# EAGLE schematic r3eflow-v3 (EAGLE 9.3.2)
DESIGNER: Rafael Silva; REVISION: hv0a

## Sheet 1 of 4: Main Controller
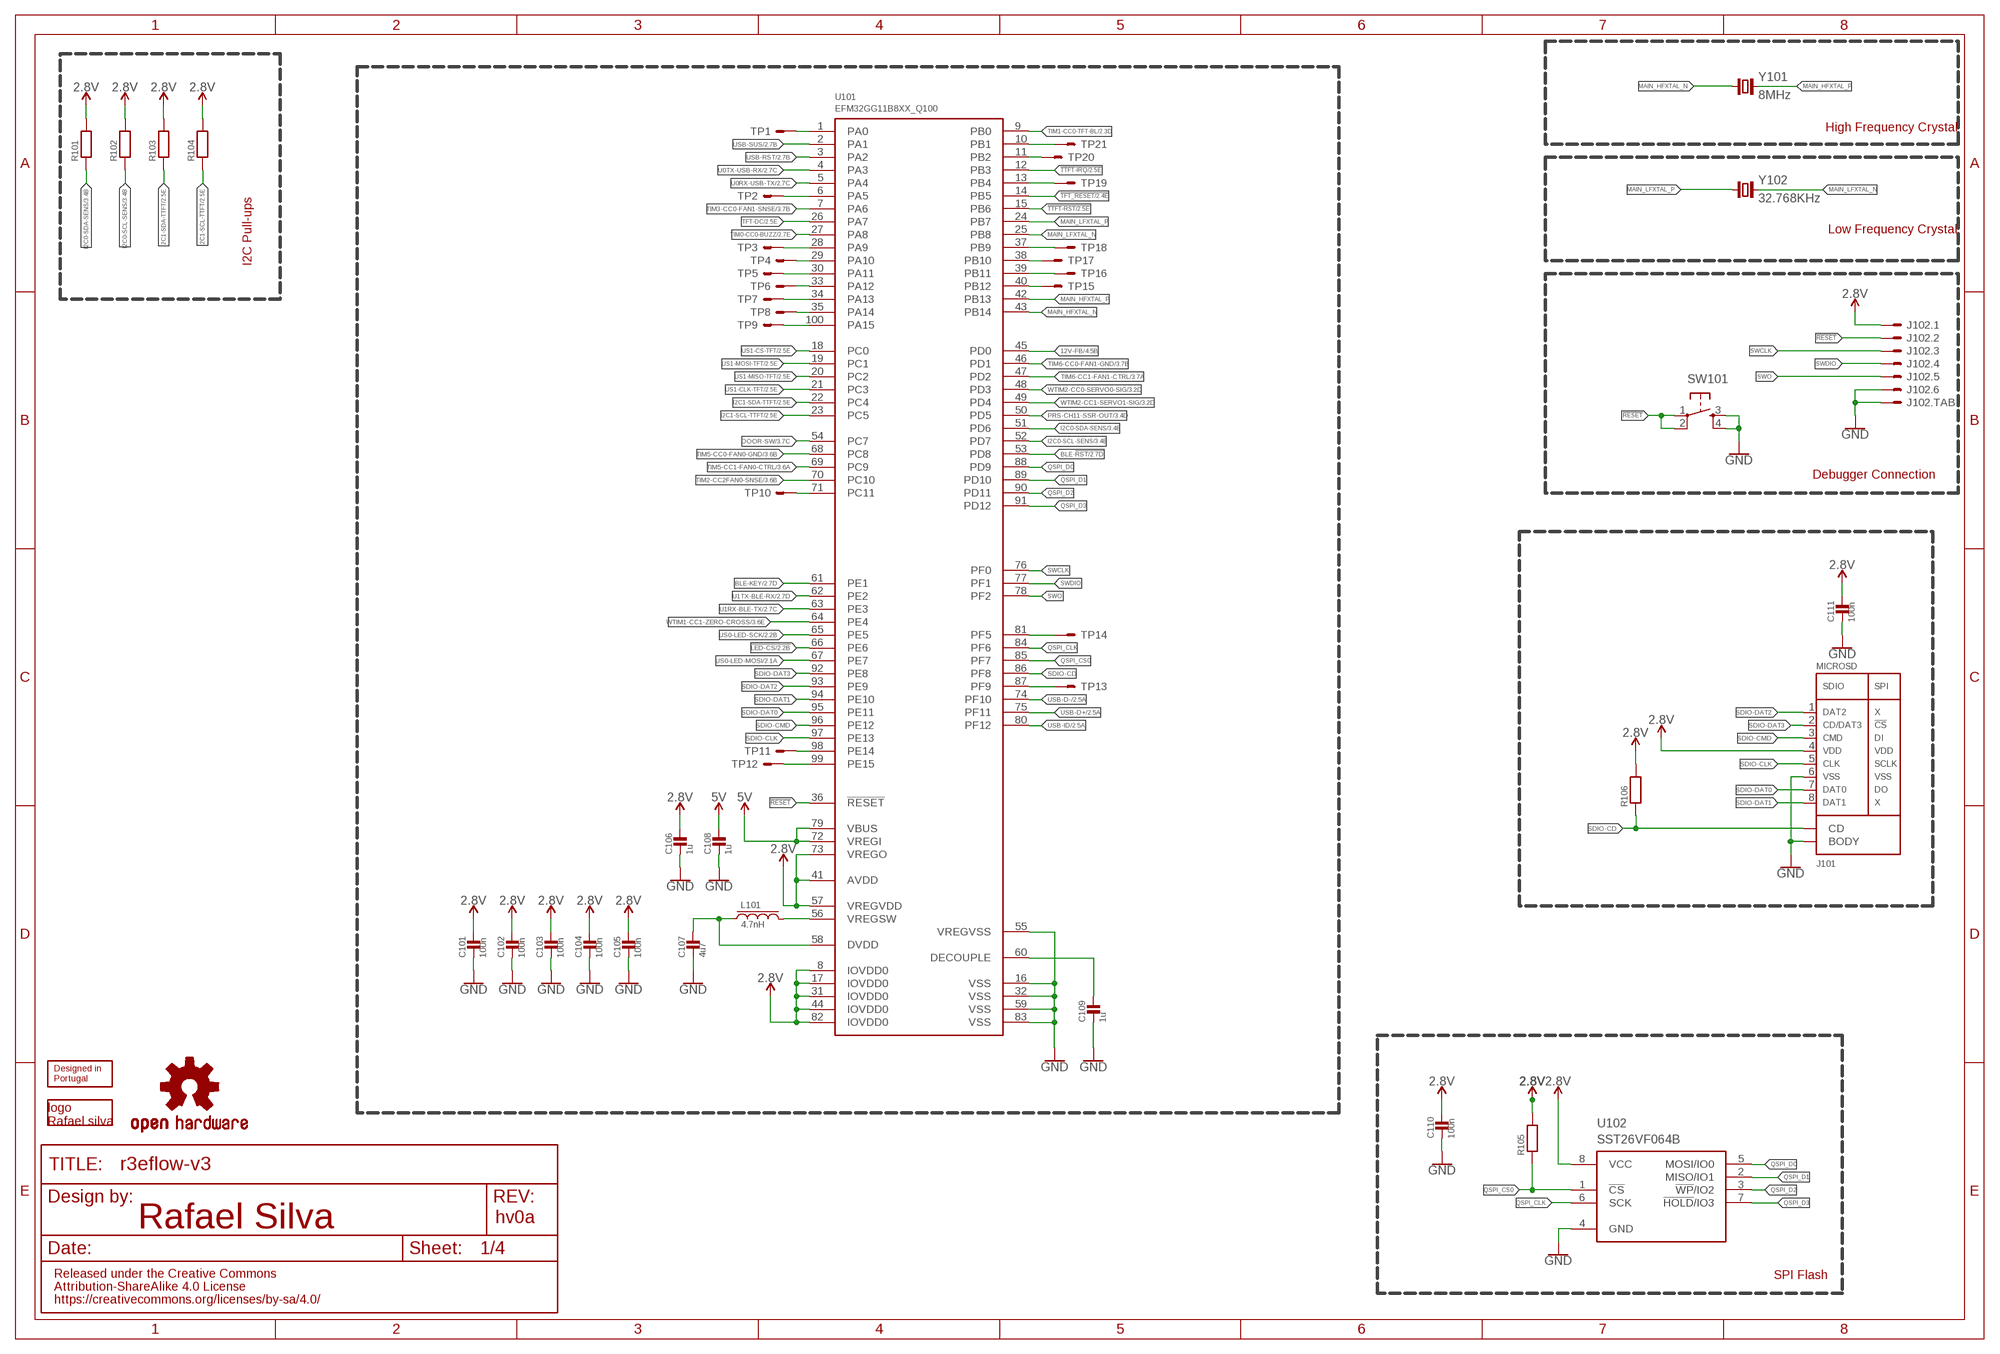
[diagram p0: schematic, sheet 1]

### Parts
C101  100n  MLCC0603  [0603_WAVE]
C102  100n  MLCC0603  [0603_WAVE]
C103  100n  MLCC0603  [0603_WAVE]
C104  100n  MLCC0603  [0603_WAVE]
C105  100n  MLCC0603  [0603_WAVE]
C106  1u  MLCC0603  [0603_WAVE]
C107  4u7  MLCC0603  [0603_WAVE]
C108  1u  MLCC0603  [0603_WAVE]
C109  1u  MLCC0603  [0603_WAVE]
C110  100n  MLCC0603  [0603_WAVE]
C111  100n  MLCC0603  [0603_WAVE]
J101  MICROSD  [MICRO-SD]
J102  SH-6  [SM06B-SSR-H-TB]
L101  4.7nH  INDUCTOR  [_0805]
LOGO101  DESIGNEDINPT  [DESIGNEDINPT]
LOGO102  RAFAEL_SILVA  [RAFAEL_SILVA_5MM_ALT_3]
LOGO103  OSHW-LOGOL  [OSHW-LOGO-L]
R101  RESISTOR0603  [0603_WAVE]
R102  RESISTOR0603  [0603_WAVE]
R103  RESISTOR0603  [0603_WAVE]
R104  RESISTOR0603  [0603_WAVE]
R105  RESISTOR0603  [0603_WAVE]
R106  RESISTOR0603  [0603_WAVE]
SW101  PUSH_BUTTON  [PUSH_BUTTON]
TP1  TEST_POINT  [TEST_POINT]
TP2  TEST_POINT  [TEST_POINT]
TP3  TEST_POINT  [TEST_POINT]
TP4  TEST_POINT  [TEST_POINT]
TP5  TEST_POINT  [TEST_POINT]
TP6  TEST_POINT  [TEST_POINT]
TP7  TEST_POINT  [TEST_POINT]
TP8  TEST_POINT  [TEST_POINT]
TP9  TEST_POINT  [TEST_POINT]
TP10  TEST_POINT  [TEST_POINT]
TP11  TEST_POINT  [TEST_POINT]
TP12  TEST_POINT  [TEST_POINT]
TP13  TEST_POINT  [TEST_POINT]
TP14  TEST_POINT  [TEST_POINT]
TP15  TEST_POINT  [TEST_POINT]
TP16  TEST_POINT  [TEST_POINT]
TP17  TEST_POINT  [TEST_POINT]
TP18  TEST_POINT  [TEST_POINT]
TP19  TEST_POINT  [TEST_POINT]
TP20  TEST_POINT  [TEST_POINT]
TP21  TEST_POINT  [TEST_POINT]
U101  EFM32GG11B8XX_Q100  [QFP100]
U102  SST26VF064B  [WSOIC8]
Y101  8MHz  CRYSTALNX5032GA  [2-SMD-5X3]
Y102  32.768KHz  CRYSTALCM200S  [CM200S]

### Nets
2.8V: C101.P$1 C102.P$1 C103.P$1 C104.P$1 C105.P$1 C106.P$1 C110.P$1 C111.P$1 J101.4 J102.1 R101.P$2 R102.P$2 R103.P$2 R104.P$2 R105.P$2 R106.P$2 U101.8(IOVDD0) U101.17(IOVDD0) U101.31(IOVDD0) U101.41(AVDD) U101.44(IOVDD0) U101.57(VREGVDD) U101.73(VREGO) U101.82(IOVDD0) U102.8(VCC) ; also sheet 2,3
5V: C108.P$1 U101.72(VREGI) U101.79(VBUS) ; also sheet 2,3,4
12V-FB: U101.45(PD0) ; also sheet 4
!LED-CS: U101.66(PE6) ; also sheet 2
!RESET: J102.2 SW101.1 SW101.2 U101.36(!RESET)
!TFT_RESET: U101.14(PB5) ; also sheet 2
!TTFT-IRQ: U101.12(PB3) ; also sheet 2
!TTFT-RST: U101.15(PB6) ; also sheet 2
BLE-!RST: U101.53(PD8) ; also sheet 2
BLE-KEY: U101.61(PE1) ; also sheet 2
DECOUPLE: C109.P$1 U101.60(DECOUPLE)
DOOR-SW: U101.54(PC7) ; also sheet 3
DVDD: C107.P$1 L101.1 U101.58(DVDD)
GND: C101.P$2 C102.P$2 C103.P$2 C104.P$2 C105.P$2 C106.P$2 C107.P$2 C108.P$2 C109.P$2 C110.P$2 C111.P$2 J101.6 J101.BODY1(BODY) J101.BODY2(BODY) J101.BODY3(BODY) J101.BODY4(BODY) J102.6 J102.FIT@1 J102.FIT@2 SW101.3 SW101.4 U101.16(VSS) U101.32(VSS) U101.55(VREGVSS) U101.59(VSS) U101.83(VSS) U102.4(GND) ; also sheet 2,3,4
I2C0-SCL-SENS: R102.P$1 U101.52(PD7) ; also sheet 3
I2C0-SDA-SENS: R101.P$1 U101.51(PD6) ; also sheet 3
I2C1-SCL-TTFT: R104.P$1 U101.23(PC5) ; also sheet 2
I2C1-SDA-TTFT: R103.P$1 U101.22(PC4) ; also sheet 2
MAIN_HFXTAL_N: U101.43(PB14) Y101.1
MAIN_HFXTAL_P: U101.42(PB13) Y101.2
MAIN_LFXTAL_N: U101.25(PB8) Y102.4
MAIN_LFXTAL_P: U101.24(PB7) Y102.1
PA0: TP1.1(S) U101.1(PA0)
PA5: TP2.1(S) U101.6(PA5)
PA9: TP3.1(S) U101.28(PA9)
PA10: TP4.1(S) U101.29(PA10)
PA11: TP5.1(S) U101.30(PA11)
PA12: TP6.1(S) U101.33(PA12)
PA13: TP7.1(S) U101.34(PA13)
PA14: TP8.1(S) U101.35(PA14)
PA15: TP9.1(S) U101.100(PA15)
PB1: TP21.1(S) U101.10(PB1)
PB2: TP20.1(S) U101.11(PB2)
PB4: TP19.1(S) U101.13(PB4)
PB9: TP18.1(S) U101.37(PB9)
PB10: TP17.1(S) U101.38(PB10)
PB11: TP16.1(S) U101.39(PB11)
PB12: TP15.1(S) U101.40(PB12)
PC11: TP10.1(S) U101.71(PC11)
PE14: TP11.1(S) U101.98(PE14)
PE15: TP12.1(S) U101.99(PE15)
PF5: TP14.1(S) U101.81(PF5)
PF9: TP13.1(S) U101.87(PF9)
PRS-CH11-SSR-OUT: U101.50(PD5) ; also sheet 3
QSPI_CLK: U101.84(PF6) U102.6(SCK)
QSPI_CS0: R105.P$1 U101.85(PF7) U102.1(!CS!)
QSPI_D0: U101.88(PD9) U102.5(MOSI/IO0)
QSPI_D1: U101.89(PD10) U102.2(MISO/IO1)
QSPI_D2: U101.90(PD11) U102.3(!WP!/IO2)
QSPI_D3: U101.91(PD12) U102.7(!HOLD!/IO3)
SDIO-CD: J101.9(CD) R106.P$1 U101.86(PF8)
SDIO-CLK: J101.5 U101.97(PE13)
SDIO-CMD: J101.3 U101.96(PE12)
SDIO-DAT0: J101.7 U101.95(PE11)
SDIO-DAT1: J101.8 U101.94(PE10)
SDIO-DAT2: J101.1 U101.93(PE9)
SDIO-DAT3: J101.2 U101.92(PE8)
SWCLK: J102.3 U101.76(PF0)
SWDIO: J102.4 U101.77(PF1)
SWO: J102.5 U101.78(PF2)
TFT-DC: U101.26(PA7) ; also sheet 2
TIM0-CC0-BUZZ: U101.27(PA8) ; also sheet 2
TIM1-CC0-TFT-BL: U101.9(PB0) ; also sheet 2
TIM2-CC2FAN0-SNSE: U101.70(PC10) ; also sheet 3
TIM3-CC0-FAN1-SNSE: U101.7(PA6) ; also sheet 3
TIM5-CC0-FAN0-GND: U101.68(PC8) ; also sheet 3
TIM5-CC1-FAN0-CTRL: U101.69(PC9) ; also sheet 3
TIM6-CC0-FAN1-GND: U101.46(PD1) ; also sheet 3
TIM6-CC1-FAN1-CTRL: U101.47(PD2) ; also sheet 3
U0RX-USB-TX: U101.5(PA4) ; also sheet 2
U0TX-USB-RX: U101.4(PA3) ; also sheet 2
U1RX-BLE-TX: U101.63(PE3) ; also sheet 2
U1TX-BLE-RX: U101.62(PE2) ; also sheet 2
US0-LED-MOSI: U101.67(PE7) ; also sheet 2
US0-LED-SCK: U101.65(PE5) ; also sheet 2
US1-CLK-TFT: U101.21(PC3) ; also sheet 2
US1-CS-TFT: U101.18(PC0) ; also sheet 2
US1-MISO-TFT: U101.20(PC2) ; also sheet 2
US1-MOSI-TFT: U101.19(PC1) ; also sheet 2
USB-D+: U101.75(PF11) ; also sheet 2
USB-D-: U101.74(PF10) ; also sheet 2
USB-ID: U101.80(PF12) ; also sheet 2
USB-RST: U101.3(PA2) ; also sheet 2
USB-SUS: U101.2(PA1) ; also sheet 2
VREGSW: L101.2 U101.56(VREGSW)
WTIM1-CC1-ZERO-CROSS: U101.64(PE4) ; also sheet 3
WTIM2-CC0-SERVO0-SIG: U101.48(PD3) ; also sheet 3
WTIM2-CC1-SERVO1-SIG: U101.49(PD4) ; also sheet 3

### Notes on the sheet
- High Frequency Crystal
- Low Frequency Crystal
- I2C Pull-ups
- Debugger Connection
- SPI Flash

## Sheet 2 of 4: User Interface
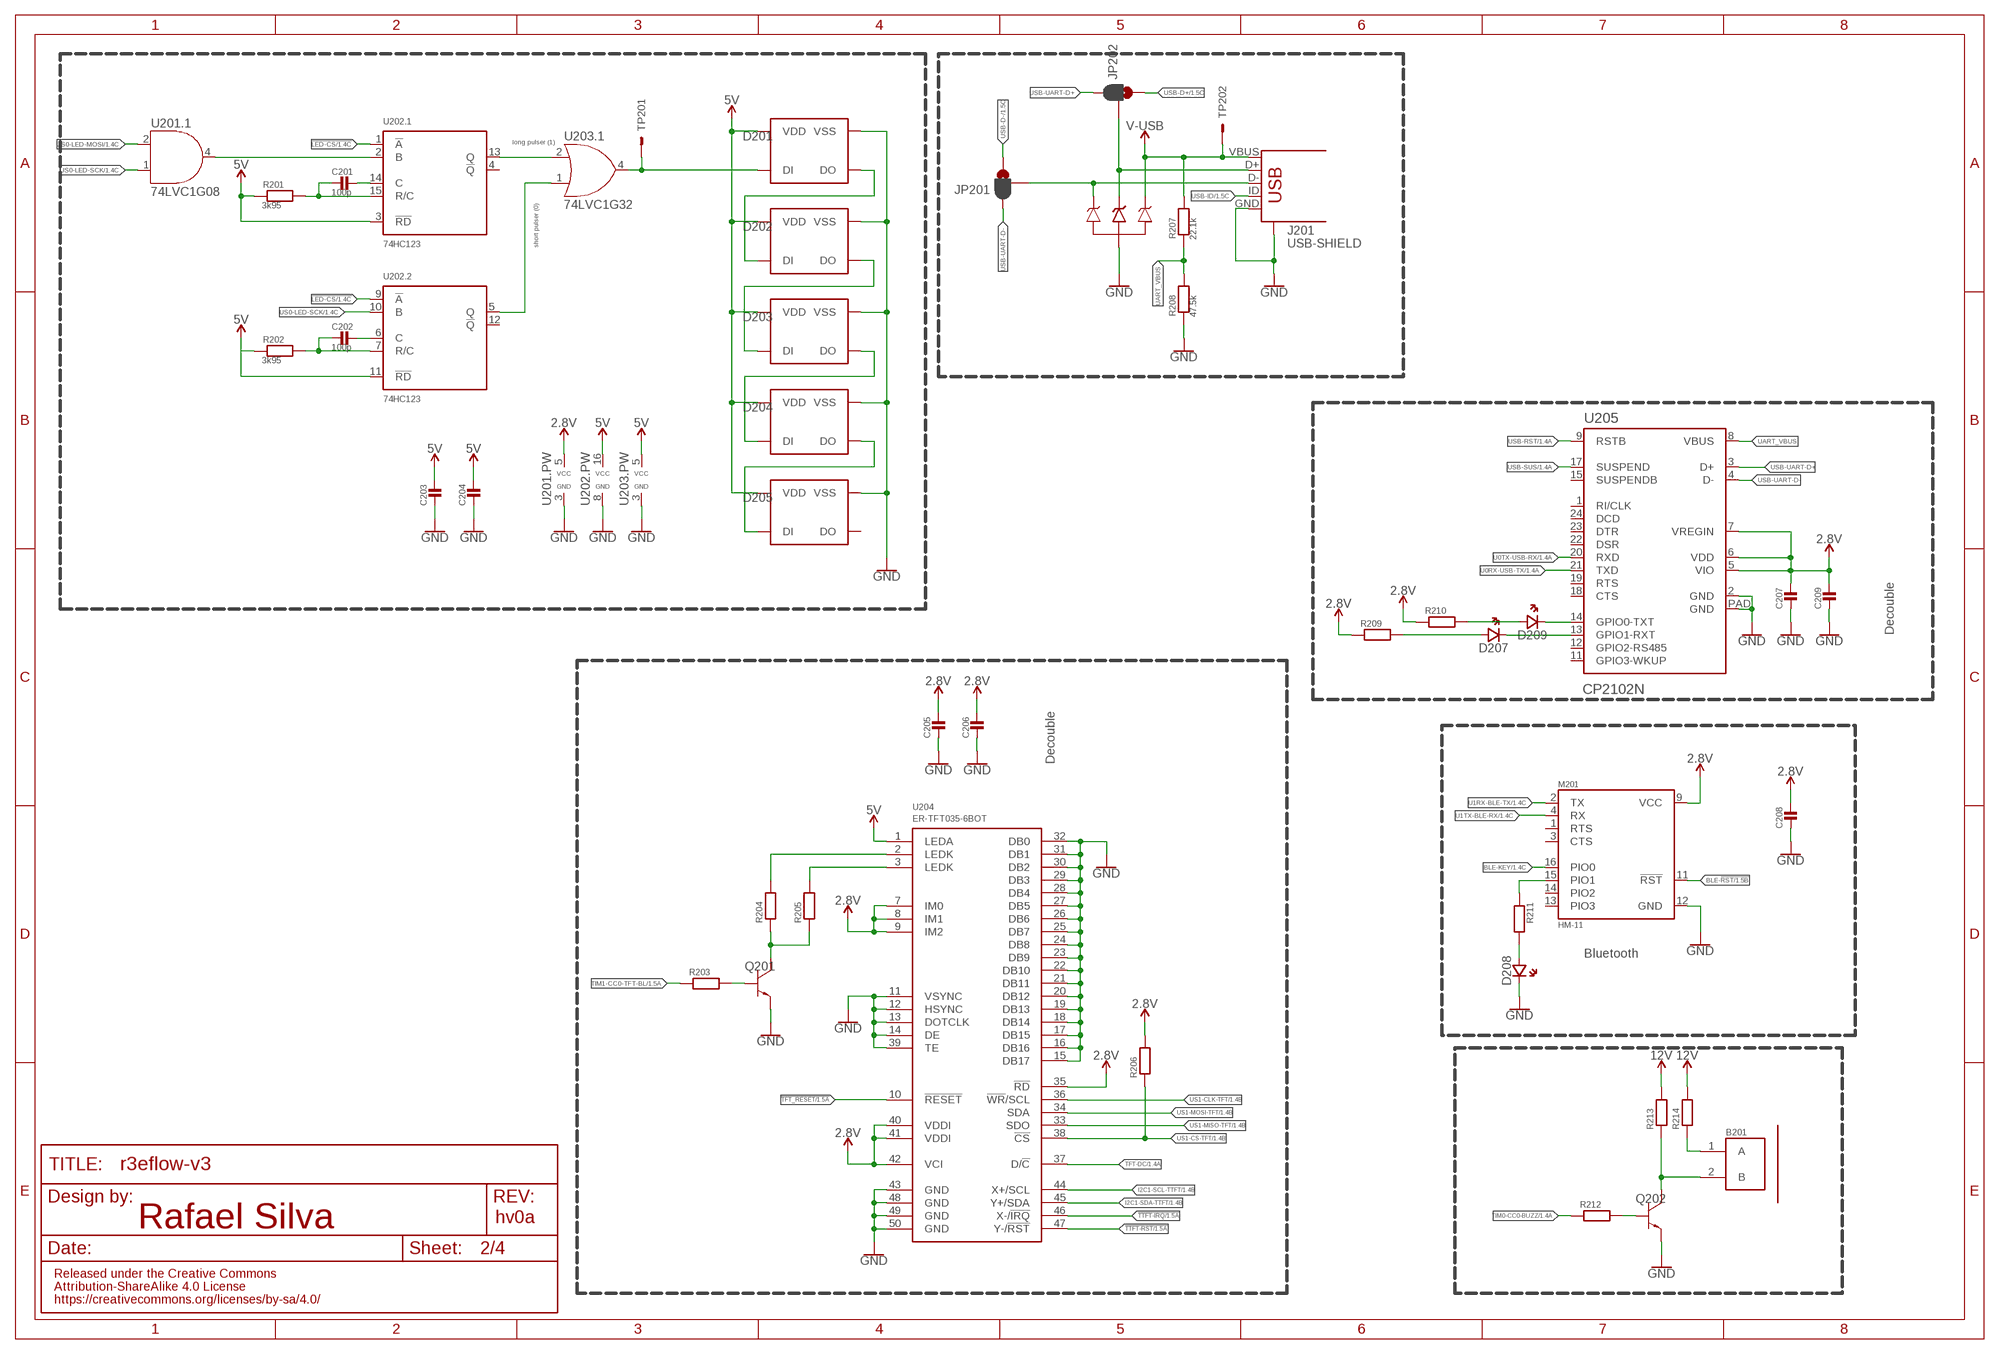
[diagram p1: schematic, sheet 2]

### Parts
B201  PKLCS1212E2400-R1  [BUZZ_PIEZO_SMD]
C201  100p  MLCC0603  [0603_WAVE]
C202  100p  MLCC0603  [0603_WAVE]
C203  MLCC0603  [0603_WAVE]
C204  MLCC0603  [0603_WAVE]
C205  MLCC0603  [0603_WAVE]
C206  MLCC0603  [0603_WAVE]
C207  MLCC0603  [0603_WAVE]
C208  MLCC0603  [0603_WAVE]
C209  MLCC0603  [0603_WAVE]
D201  WS2812B  WS2812B3535  [3535]
D202  WS2812B  WS2812B3535  [3535]
D203  WS2812B  WS2812B3535  [3535]
D204  WS2812B  WS2812B3535  [3535]
D205  WS2812B  WS2812B3535  [3535]
D206  SP0503BAHT  [SOT143]
D207  LED0603  [CHIPLED_0603]
D208  LED0603  [CHIPLED_0603]
D209  LED0603  [CHIPLED_0603]
J201  USB-SHIELD  [USB-M-S1]
JP201  JUMPER-SMT_3_1-NC_PASTE_SILK  [SMT-JUMPER_3_1-NC_PASTE_SILK]
JP202  JUMPER-SMT_3_1-NC_PASTE_SILK  [SMT-JUMPER_3_1-NC_PASTE_SILK]
M201  HM-11  [HM-11]
Q201  BC817-40  [SOT-23-3]
Q202  BC817-40  [SOT-23-3]
R201  3k95  RESISTOR0603  [0603_WAVE]
R202  3k95  RESISTOR0603  [0603_WAVE]
R203  RESISTOR0603  [0603_WAVE]
R204  RESISTOR0603  [0603_WAVE]
R205  RESISTOR0603  [0603_WAVE]
R206  RESISTOR0603  [0603_WAVE]
R207  22.1k  RESISTOR0603  [0603_WAVE]
R208  47.5k  RESISTOR0603  [0603_WAVE]
R209  RESISTOR0603  [0603_WAVE]
R210  RESISTOR0603  [0603_WAVE]
R211  RESISTOR0603  [0603_WAVE]
R212  RESISTOR0603  [0603_WAVE]
R213  RESISTOR0603  [0603_WAVE]
R214  RESISTOR0603  [0603_WAVE]
TP201  TEST_POINT  [TEST_POINT]
TP202  TEST_POINT  [TEST_POINT]
U201  74LVC1G08  [SC-70-5]
U202  74HC123  [TSSOP-16]
U203  74LVC1G32  [SC-70-5]
U204  ER-TFT035-6BOT  [ZIF50-TFT_BACK]
U205  CP2102N  [QFN24]

### Nets
2.8V: C205.P$1 C206.P$1 C207.P$1 C208.P$1 C209.P$1 M201.9(VCC) R206.P$2 R209.P$1 R210.P$1 U201.5(.PW:VCC) U204.7(IM0) U204.8(IM1) U204.9(IM2) U204.35(!RD) U204.40(VDDI) U204.41(VDDI) U204.42(VCI) U205.5(VIO) U205.6(VDD) U205.7(VREGIN) ; also sheet 1,3
5V: C203.P$1 C204.P$1 D201.3(VDD) D202.3(VDD) D203.3(VDD) D204.3(VDD) D205.3(VDD) R201.P$1 R202.P$1 U202.3(.1:!RD) U202.11(.2:!RD) U202.16(.PW:VCC) U203.5(.PW:VCC) U204.1(LEDA) ; also sheet 1,3,4
12V: R213.P$2 R214.P$2 ; also sheet 3,4
!LED-CS: U202.1(.1:!A) U202.9(.2:!A) ; also sheet 1
!TFT_RESET: U204.10(!RESET) ; also sheet 1
!TTFT-IRQ: U204.46(X-/!IRQ!) ; also sheet 1
!TTFT-RST: U204.47(Y-/!RST!) ; also sheet 1
BLE-!RST: M201.11(!RST!) ; also sheet 1
BLE-KEY: M201.16(PIO0) ; also sheet 1
D8-DI: D201.2(DI) TP201.1(S) U203.4(.1:Y)
D8_DO: D201.4(DO) D202.2(DI)
D9-DO: D202.4(DO) D203.2(DI)
D10-DO: D203.4(DO) D204.2(DI)
D11-DO: D204.4(DO) D205.2(DI)
GND: C203.P$2 C204.P$2 C205.P$2 C206.P$2 C207.P$2 C208.P$2 C209.P$2 D201.1(VSS) D202.1(VSS) D203.1(VSS) D204.1(VSS) D205.1(VSS) D206.1 D208.C(CA) J201.GND J201.GND@1(CASE) J201.GND@2(CASE) J201.GND@3(CASE) J201.GND@4(CASE) M201.12(GND) Q201.P$2(EM2) Q202.P$2(EM2) R208.P$1 U201.3(.PW:GND) U202.8(.PW:GND) U203.3(.PW:GND) U204.11(VSYNC) U204.12(HSYNC) U204.13(DOTCLK) U204.14(DE) U204.15(DB17) U204.16(DB16) U204.17(DB15) U204.18(DB14) U204.19(DB13) U204.20(DB12) U204.21(DB11) U204.22(DB10) U204.23(DB9) U204.24(DB8) U204.25(DB7) U204.26(DB6) U204.27(DB5) U204.28(DB4) U204.29(DB3) U204.30(DB2) U204.31(DB1) U204.32(DB0) U204.39(TE) U204.43(GND) U204.48(GND) U204.49(GND) U204.50(GND) U205.2(GND) U205.PAD(GND) ; also sheet 1,3,4
I2C1-SCL-TTFT: U204.44(X+/SCL) ; also sheet 1
I2C1-SDA-TTFT: U204.45(Y+/SDA) ; also sheet 1
N$4: B201.1(A) R214.P$1
N$13: D207.C(CA) U205.13(GPIO1-RXT)
N$15: D209.C(CA) U205.14(GPIO0-TXT)
N$16: D209.A(AN) R210.P$2
N$17: B201.2(B) Q202.P$3(C03) R213.P$1
N$18: Q202.P$1(BA1) R212.P$2
N$19: D207.A(AN) R209.P$2
N$25: Q201.P$1(BA1) R203.P$2
N$35: D208.A(AN) R211.P$2
N$36: M201.15(PIO1) R211.P$1
N$69: U202.5(.2:Q) U203.1(.1:B)
N$77: U202.13(.1:Q) U203.2(.1:A)
N$78: U201.4(.1:Y) U202.2(.1:B)
N$84: D206.3 J201.D+ JP202.2
N$85: D206.2 J201.D- JP201.2
TFT-DC: U204.37(D/!C!) ; also sheet 1
TFT-LEDK: Q201.P$3(C03) R204.P$1 R205.P$1
TFT-LEDK1: R204.P$2 U204.2(LEDK)
TFT-LEDK2: R205.P$2 U204.3(LEDK)
TIM0-CC0-BUZZ: R212.P$1 ; also sheet 1
TIM1-CC0-TFT-BL: R203.P$1 ; also sheet 1
U0RX-USB-TX: U205.21(TXD) ; also sheet 1
U0TX-USB-RX: U205.20(RXD) ; also sheet 1
U1RX-BLE-TX: M201.2(TX) ; also sheet 1
U1TX-BLE-RX: M201.4(RX) ; also sheet 1
U11.1-C: C201.P$1 U202.14(.1:C)
U11.1-RC: C201.P$2 R201.P$2 U202.15(.1:R/C)
U11.2-C: C202.P$1 U202.6(.2:C)
U11.2-RC: C202.P$2 R202.P$2 U202.7(.2:R/C)
UART_VBUS: R207.P$1 R208.P$2 U205.8(VBUS)
US0-LED-MOSI: U201.2(.1:A) ; also sheet 1
US0-LED-SCK: U201.1(.1:B) U202.10(.2:B) ; also sheet 1
US1-CLK-TFT: U204.36(!WR!/SCL) ; also sheet 1
US1-CS-TFT: R206.P$1 U204.38(!CS) ; also sheet 1
US1-MISO-TFT: U204.33(SDO) ; also sheet 1
US1-MOSI-TFT: U204.34(SDA) ; also sheet 1
USB-D+: JP202.1 ; also sheet 1
USB-D-: JP201.1 ; also sheet 1
USB-ID: J201.ID ; also sheet 1
USB-RST: U205.9(RSTB) ; also sheet 1
USB-SUS: U205.17(SUSPEND) ; also sheet 1
USB-UART-D+: JP202.3 U205.3(D+)
USB-UART-D-: JP201.3 U205.4(D-)
V_USB: D206.4 J201.VBUS R207.P$2 TP202.1(S) ; supply symbol labelled V-USB
Unconnected: D205.4(DO) M201.1(RTS) M201.3(CTS) M201.13(PIO3) M201.14(PIO2) U202.4(.1:!Q) U202.12(.2:!Q) U205.1(RI/CLK) U205.11(GPIO3-WKUP) U205.12(GPIO2-RS485) U205.15(SUSPENDB) U205.18(CTS) U205.19(RTS) U205.22(DSR) U205.23(DTR) U205.24(DCD)

### Notes on the sheet
- long pulser (1)
- short pulser (0)
- Decouble
- Decouble
- Bluetooth

## Sheet 3 of 4: Feedback and Control
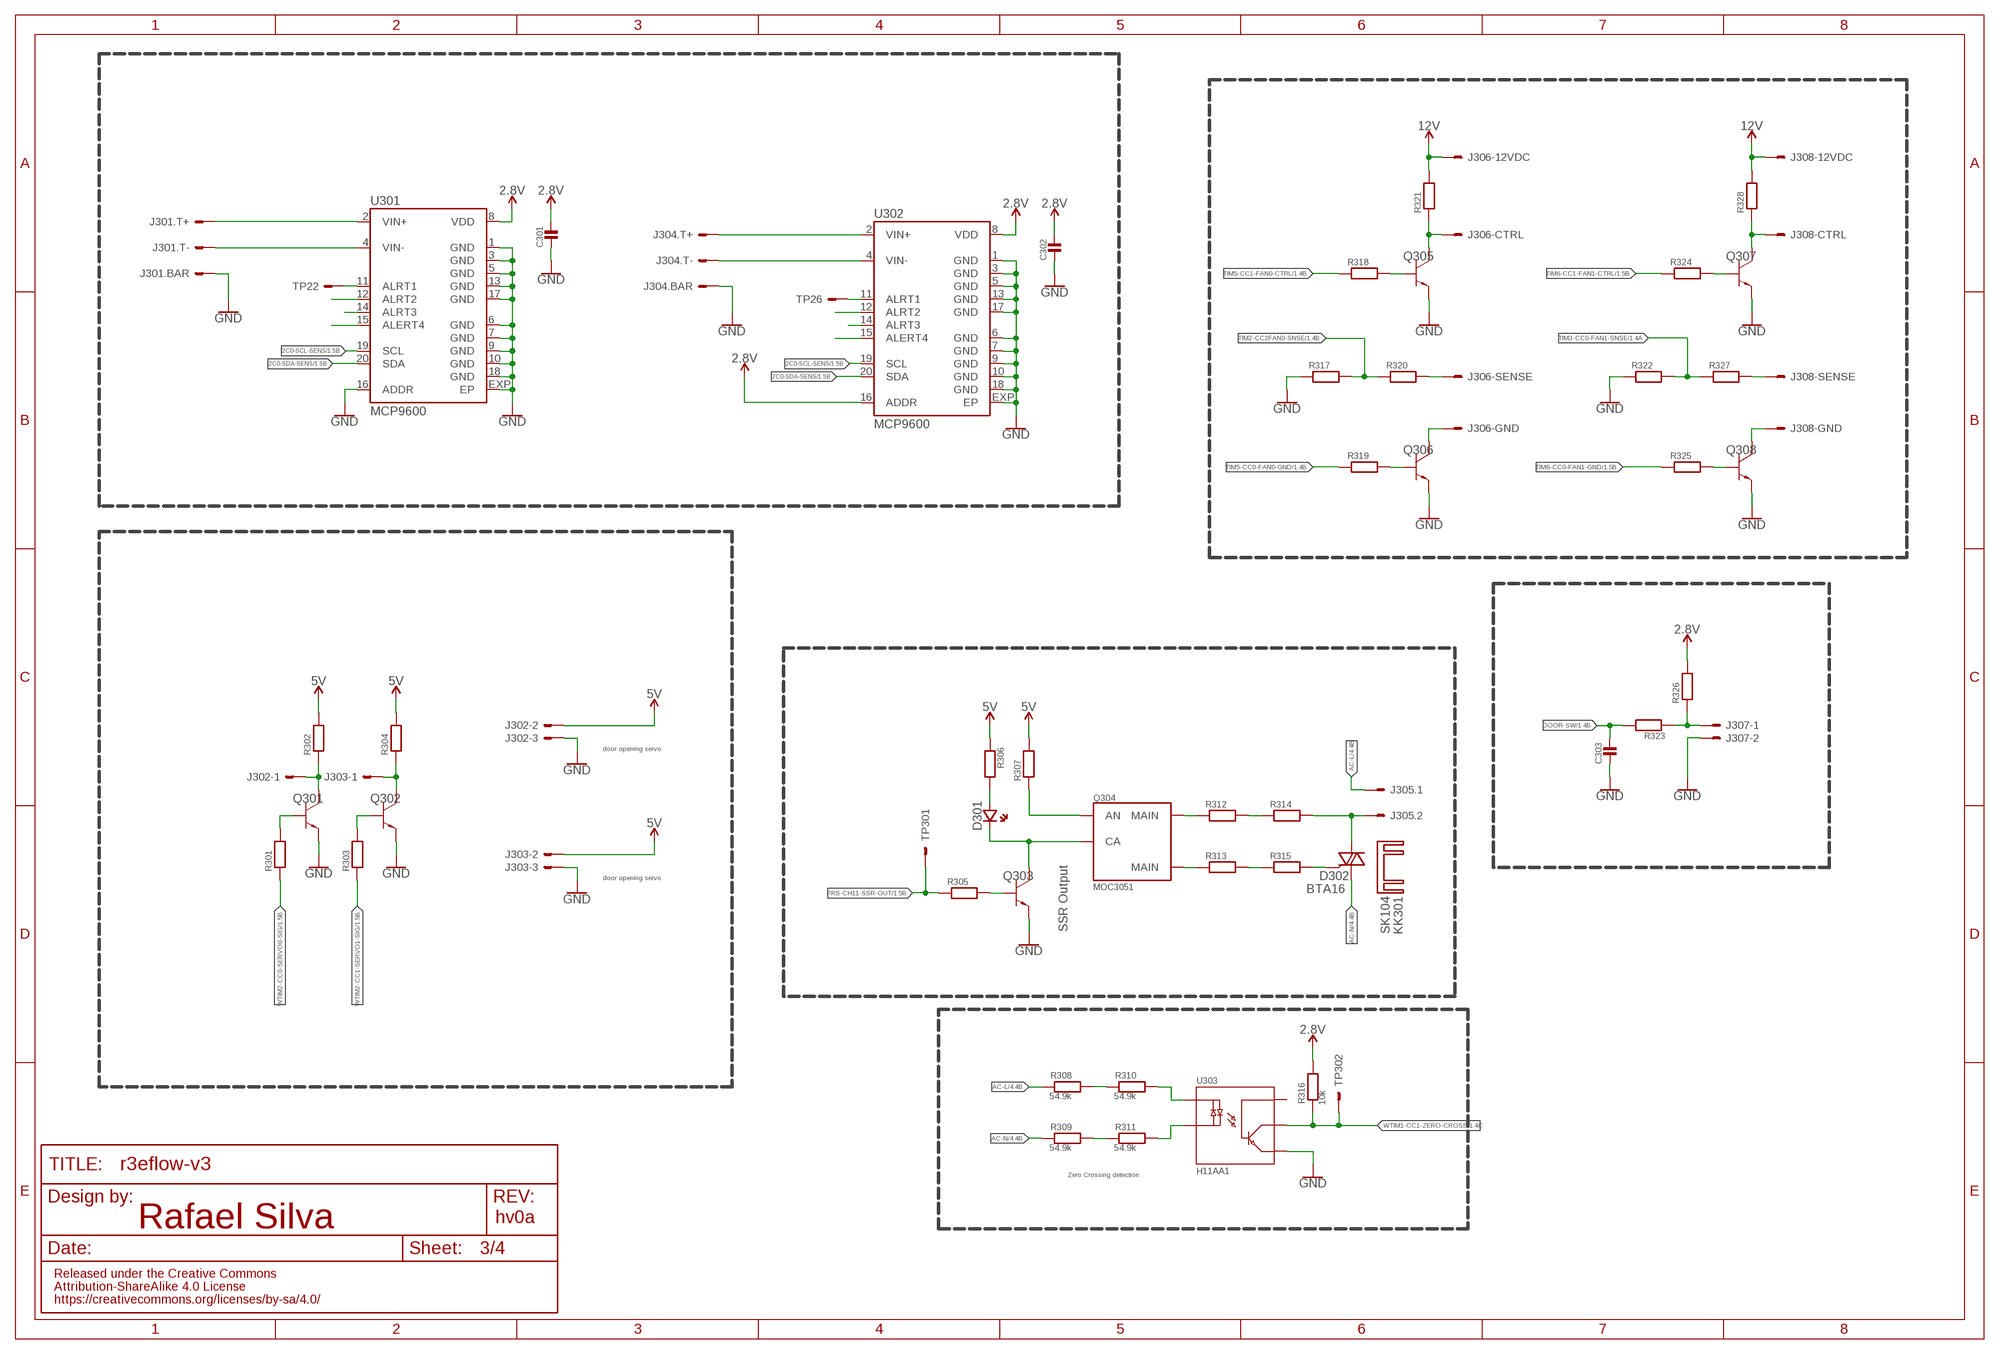
[diagram p2: schematic, sheet 3]

### Parts
C301  MLCC0603  [0603_WAVE]
C302  MLCC0603  [0603_WAVE]
C303  MLCC0603  [0603_WAVE]
D301  LED0603  [CHIPLED_0603]
D302  BTA16  [TO220DS]
J301  PCC-SMP  [PCC-SMP]
J302  3X1_2.54  [3X1_2.54]
J303  3X1_2.54  [3X1_2.54]
J304  PCC-SMP  [PCC-SMP]
J305  2EDG-2P  [2EDG-2P]
J306  4P-PC-FAN  [KF2510-3+1P]
J307  2X1_2.54  [2X1_2.54]
J308  4P-PC-FAN  [KF2510-3+1P]
KK301  SK104  [SK104]
Q301  BC817-40  [SOT-23-3]
Q302  BC817-40  [SOT-23-3]
Q303  BC817-40  [SOT-23-3]
Q304  MOC3051  [DIP-6-SMD]
Q305  BC817-40  [SOT-23-3]
Q306  BC817-40  [SOT-23-3]
Q307  BC817-40  [SOT-23-3]
Q308  BC817-40  [SOT-23-3]
R301  RESISTOR0603  [0603_WAVE]
R302  RESISTOR0603  [0603_WAVE]
R303  RESISTOR0603  [0603_WAVE]
R304  RESISTOR0603  [0603_WAVE]
R305  RESISTOR0603  [0603_WAVE]
R306  RESISTOR0603  [0603_WAVE]
R307  RESISTOR0603  [0603_WAVE]
R308  54.9k  RESISTOR_1206  [_1206]
R309  54.9k  RESISTOR_1206  [_1206]
R310  54.9k  RESISTOR_1206  [_1206]
R311  54.9k  RESISTOR_1206  [_1206]
R312  RESISTOR_1206  [_1206]
R313  RESISTOR_1206  [_1206]
R314  RESISTOR_1206  [_1206]
R315  RESISTOR_1206  [_1206]
R316  10k  RESISTOR0603  [0603_WAVE]
R317  RESISTOR0603  [0603_WAVE]
R318  RESISTOR0603  [0603_WAVE]
R319  RESISTOR0603  [0603_WAVE]
R320  RESISTOR0603  [0603_WAVE]
R321  RESISTOR0603  [0603_WAVE]
R322  RESISTOR0603  [0603_WAVE]
R323  RESISTOR0603  [0603_WAVE]
R324  RESISTOR0603  [0603_WAVE]
R325  RESISTOR0603  [0603_WAVE]
R326  RESISTOR0603  [0603_WAVE]
R327  RESISTOR0603  [0603_WAVE]
R328  RESISTOR0603  [0603_WAVE]
TP22  TEST_POINT  [TEST_POINT]
TP26  TEST_POINT  [TEST_POINT]
TP301  TEST_POINT  [TEST_POINT]
TP302  TEST_POINT  [TEST_POINT]
U301  MCP9600  [TQFN20-5X5]
U302  MCP9600  [TQFN20-5X5]
U303  H11AA1  [DIP-6-SMD]

### Nets
2.8V: C301.P$1 C302.P$1 R316.P$2 R326.P$2 U301.8(VDD) U302.8(VDD) U302.16(ADDR) ; also sheet 1,2
5V: J302.P$2 J303.P$2 R302.P$2 R304.P$2 R306.P$1 R307.P$2 ; also sheet 1,2,4
12V: J306.2 J308.2 R321.P$2 R328.P$2 ; also sheet 2,4
AC-L: J305.P$1 R308.1 ; also sheet 4
AC-N: D302.A1 R309.1 ; also sheet 4
DOOR-SW: C303.P$1 R323.P$2 ; also sheet 1
GND: C301.P$2 C302.P$2 C303.P$2 J301.3-BAR J301.4-BAR J302.P$3 J303.P$3 J304.3-BAR J304.4-BAR J307.2 Q301.P$2(EM2) Q302.P$2(EM2) Q303.P$2(EM2) Q305.P$2(EM2) Q306.P$2(EM2) Q307.P$2(EM2) Q308.P$2(EM2) R317.P$1 R322.P$1 U301.1(GND) U301.3(GND) U301.5(GND) U301.6(GND) U301.7(GND) U301.9(GND) U301.10(GND) U301.13(GND) U301.16(ADDR) U301.17(GND) U301.18(GND) U301.EXP(EP) U302.1(GND) U302.3(GND) U302.5(GND) U302.6(GND) U302.7(GND) U302.9(GND) U302.10(GND) U302.13(GND) U302.17(GND) U302.18(GND) U302.EXP(EP) U303.P$4(E) ; also sheet 1,2,4
I2C0-SCL-SENS: U301.19(SCL) U302.19(SCL) ; also sheet 1
I2C0-SDA-SENS: U301.20(SDA) U302.20(SDA) ; also sheet 1
N$1: J307.1 R323.P$1 R326.P$1
N$2: D302.A2 J305.P$2 R314.2
N$5: Q303.P$1(BA1) R305.P$2
N$7: D301.C(CA) Q303.P$3(C03) Q304.P$2(CA)
N$20: R308.2 R310.1
N$21: R310.2 U303.P$1(AC)
N$29: R311.2 U303.P$2(CA)
N$30: R309.2 R311.1
N$34: Q304.P$1(AN) R307.P$1
N$37: Q304.P$4(MAIN) R312.1
N$38: Q304.P$6(MAIN) R313.1
N$39: R312.2 R314.1
N$40: R313.2 R315.1
N$42: D302.G R315.2
N$49: Q301.P$1(BA1) R301.P$2
N$50: J302.P$1 Q301.P$3(C03) R302.P$1
N$51: D301.A(AN) R306.P$2
N$52: J303.P$1 Q302.P$3(C03) R304.P$1
N$53: Q302.P$1(BA1) R303.P$2
N$56: Q306.P$1(BA1) R319.P$2
N$57: J306.1 Q306.P$3(C03)
N$58: Q305.P$1(BA1) R318.P$2
N$59: J306.4 Q305.P$3(C03) R321.P$1
N$60: Q308.P$1(BA1) R325.P$2
N$61: Q307.P$1(BA1) R324.P$2
N$62: J308.4 Q307.P$3(C03) R328.P$1
N$63: J308.1 Q308.P$3(C03)
N$64: J306.3 R320.P$2
N$65: J308.3 R327.P$2
PRS-CH11-SSR-OUT: R305.P$1 TP301.1(S) ; also sheet 1
TC_VIN0+: J301.1-T+ U301.2(VIN+)
TC_VIN0-: J301.2-T- U301.4(VIN-)
TC_VIN1+: J304.1-T+ U302.2(VIN+)
TC_VIN1-: J304.2-T- U302.4(VIN-)
TIM2-CC2FAN0-SNSE: R317.P$2 R320.P$1 ; also sheet 1
TIM3-CC0-FAN1-SNSE: R322.P$2 R327.P$1 ; also sheet 1
TIM5-CC0-FAN0-GND: R319.P$1 ; also sheet 1
TIM5-CC1-FAN0-CTRL: R318.P$1 ; also sheet 1
TIM6-CC0-FAN1-GND: R325.P$1 ; also sheet 1
TIM6-CC1-FAN1-CTRL: R324.P$1 ; also sheet 1
U4-ALRT1: TP22.1(S) U301.11(ALRT1)
U4-ALRT2: U301.12(ALRT2)
U4-ALRT3: U301.14(ALRT3)
U4-ALRT4: U301.15(ALERT4)
U7-ALRT1: TP26.1(S) U302.11(ALRT1)
U7-ALRT2: U302.12(ALRT2)
U7-ALRT3: U302.14(ALRT3)
U7-ALRT4: U302.15(ALERT4)
WTIM1-CC1-ZERO-CROSS: R316.P$1 TP302.1(S) U303.P$5(C) ; also sheet 1
WTIM2-CC0-SERVO0-SIG: R301.P$1 ; also sheet 1
WTIM2-CC1-SERVO1-SIG: R303.P$1 ; also sheet 1
Unconnected: U303.P$6(B)

### Notes on the sheet
- door opening servo
- door opening servo
- SSR Output
- Zero Crossing detection

## Sheet 4 of 4: Power
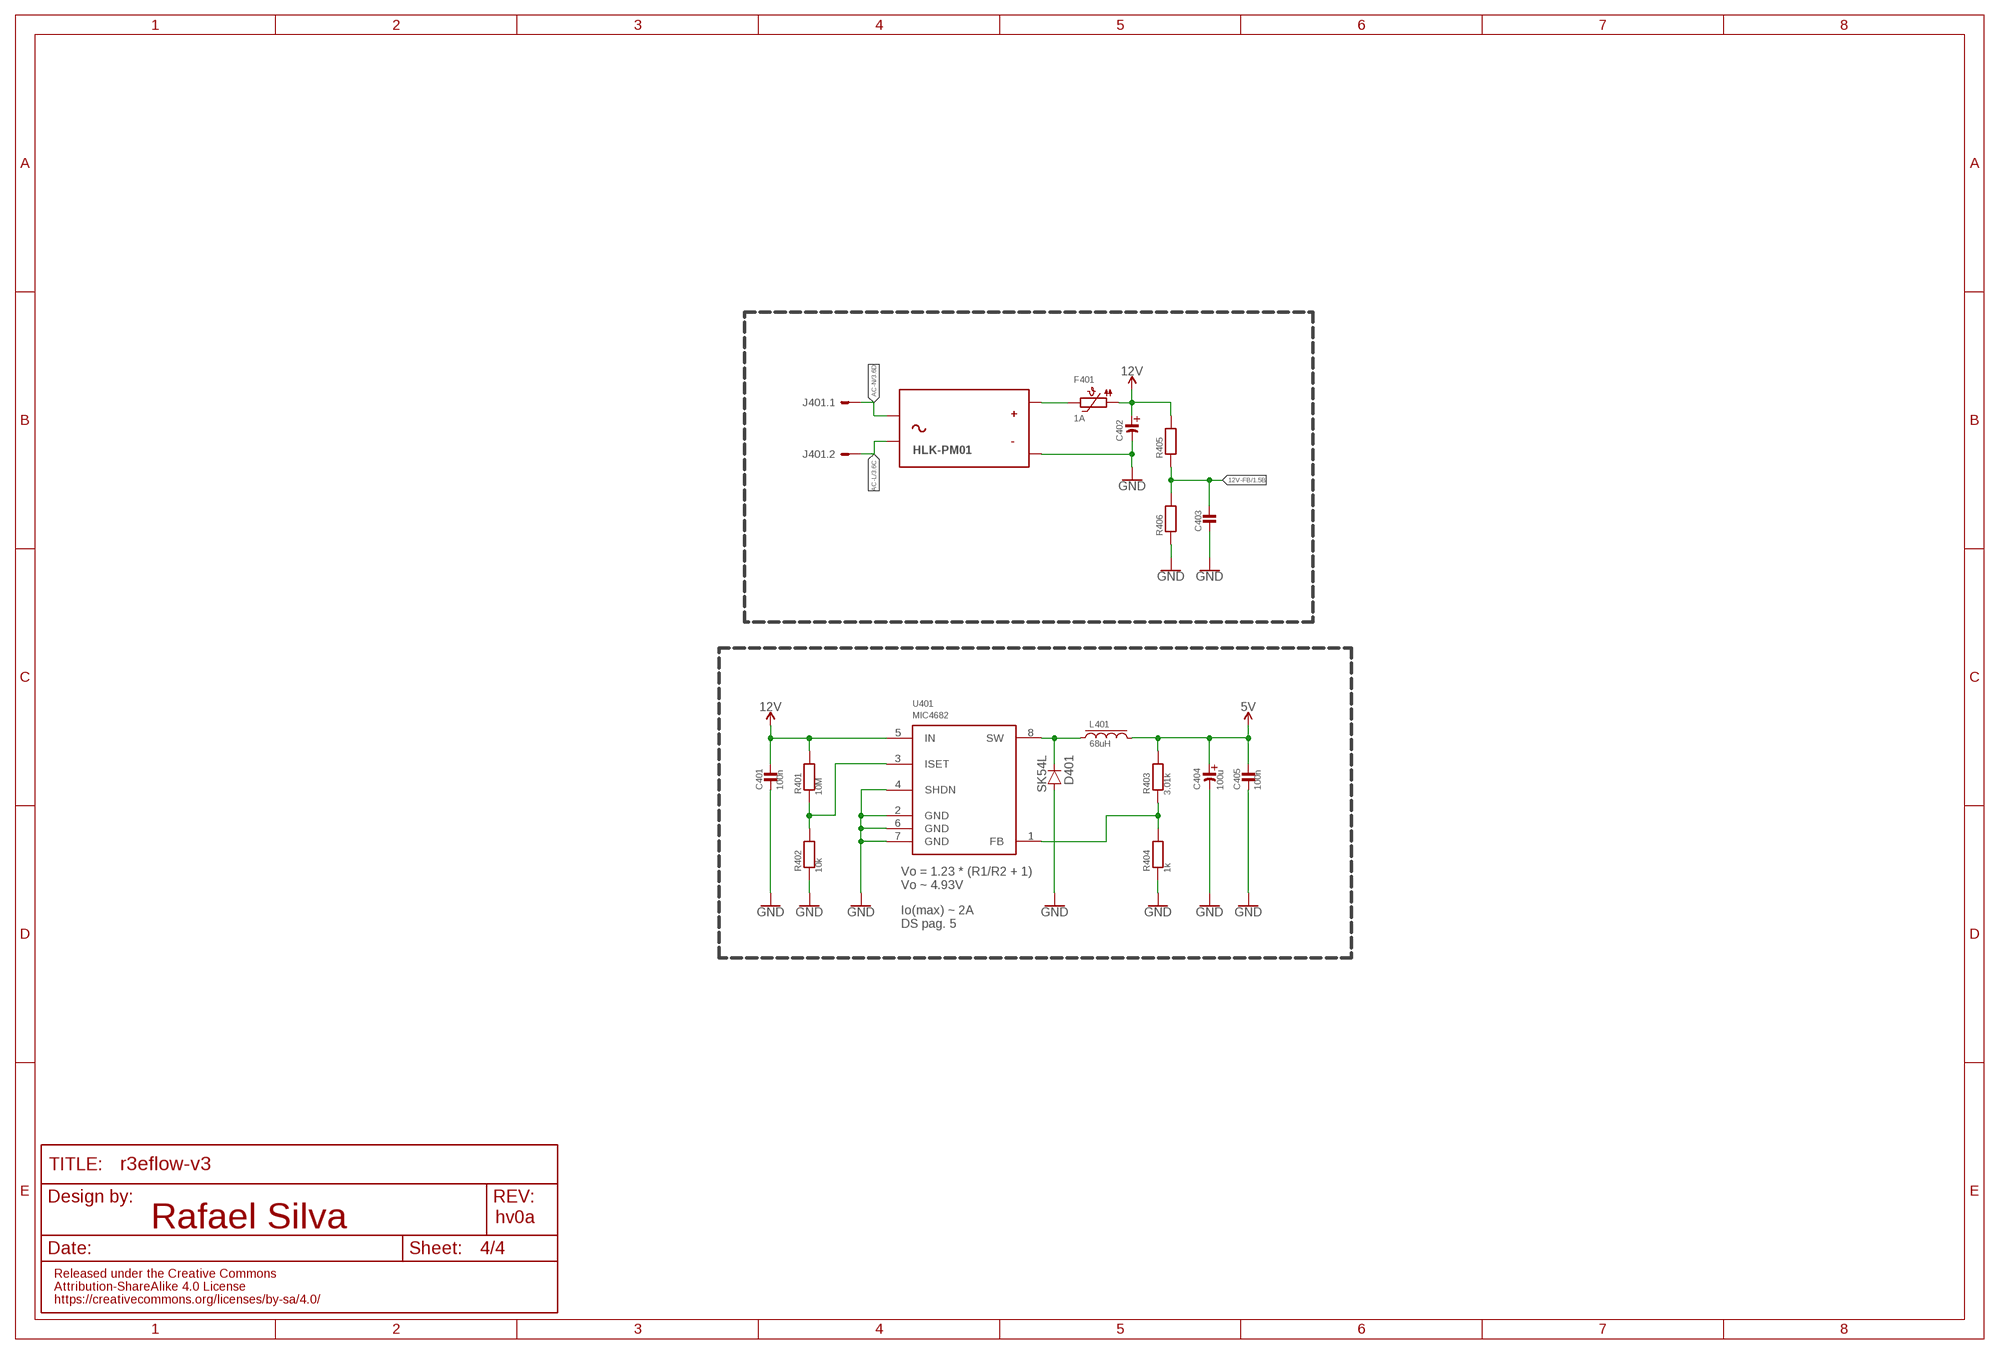
[diagram p3: schematic, sheet 4]

### Parts
ACDC401  HLK-PM01  [HLK-PM01]
C401  100n  MLCC0603  [0603_WAVE]
C402  CAPACITOR_ELD  [PANASONIC_D]
C403  MLCC0603  [0603_WAVE]
C404  100u  CAPACITOR_ELD  [PANASONIC_D]
C405  100n  MLCC0603  [0603_WAVE]
D401  SK54L  [DO214AA]
F401  1A  PTC1812  [PTC1812]
J401  2EDG-2P  [2EDG-2P]
L401  68uH  INDUCTOR1207  [1207]
R401  10M  RESISTOR0603  [0603_WAVE]
R402  10k  RESISTOR0603  [0603_WAVE]
R403  3.01k  RESISTOR0603  [0603_WAVE]
R404  1k  RESISTOR0603  [0603_WAVE]
R405  RESISTOR0603  [0603_WAVE]
R406  RESISTOR0603  [0603_WAVE]
U401  MIC4682  [SOIC8]

### Nets
5V: C404.+(AN) C405.P$1 L401.2 R403.P$2 ; also sheet 1,2,3
5V-FB: R403.P$1 R404.P$2 U401.1(FB)
12V: C401.P$1 C402.+(AN) F401.P$1 R401.P$2 R405.P$2 U401.5(IN) ; also sheet 2,3
12V-FB: C403.P$1 R405.P$1 R406.P$2 ; also sheet 1
AC-L: ACDC401.AC2 J401.P$2 ; also sheet 3
AC-N: ACDC401.AC1 J401.P$1 ; also sheet 3
GND: ACDC401.-VO C401.P$2 C402.-(CA) C403.P$2 C404.-(CA) C405.P$2 D401.A R402.P$1 R404.P$1 R406.P$1 U401.2(GND) U401.4(SHDN) U401.6(GND) U401.7(GND) ; also sheet 1,2,3
N$31: ACDC401.+VO F401.P$2
N$45: D401.C L401.1 U401.8(SW)
N$47: R401.P$1 R402.P$2 U401.3(ISET)

### Notes on the sheet
- Vo = 1.23 * (R1/R2 + 1)
  Vo ~ 4.93V
- Io(max) ~ 2A
  DS pag. 5

## Library data of the parts
ACDC401 = Power > AC\DC Converters:HLK-PM01
B201 = Eletromechanical > Buzzer:PKLCS1212E2400-R1
C101-C111 C201-C209 C301-C303 C401 C403 C405 = Passive Components > Capacitors > Multilayer Ceramic Capacitors MLCC:MLCC: KEMET’s X7R dielectric features a 125°C maximum operating temperature and is considered temperature stable. The Electronics Components, Assemblies and Materials Association (EIA) characterizes X7R dielectric as a Class II material. Components of this classification are fixed, ceramic dielectric capacitors suited for bypass and decoupling applications or for frequency discriminating circuits where Q and stability of capacitance characteristics are not critical. X7R exhibits a predictable change in capacitance with respect to time and voltage, boasting a minimal change in capacitance with reference to ambient temperature. Capacitance change is limited to ±15% from −55°C to +125°C.
C402 C404 = Passive Components > Capacitors > Aluminium Electrolytic Capacitors:CAPACITOR_EL
D201-D205 = Opto-electronics > LED Emitters:WS2812B
D206 = Circuit Protection > ESD Suppressors \ TVS Diodes:SP0503BAHT
D207-D209 D301 = Opto-electronics > LED Emitters:LED: LED 0603 - 0603 Surface Mount Package 2mA: Green LED - Low Power (3.9mcd, 2ma, 1.7Vf) - Digikey: 475-2709-2-ND Orange LED - Low Power (9.8mcd, 2ma, 1.8Vf) - Digikey: 475-1194-2-ND Red LED - Low Power (5mcd, 2ma, 1.8Vf) - Digikey: 475-1195-2-ND Yellow LED - Low Power (7mcd, 2ma, 1.8Vf) - Digikey: 475-1196-2-ND 5mA: Blue LED - Low Power (17mcd, 5ma, 2.9Vf) - Digikey: LNJ937W8CRACT-ND 0805 - 0805 Surface Mount Package 2mA: Red LED (8.8mcd, 2mA, 1.8Vf, Clear) - Low Power [Digikey: 475-2510-1-ND] Green LED (5mcd, 2mA, 1.8Vf, Clear) - Low Power [Digikey: 475-2730-1-ND] Yellow LED (11.3mcd, 2mA, 1.8Vf, Clear) - Low Power [Digikey: 475-2555-1-ND] 20mA: Red LED (104mcd, 20mA, Diffused) - LS R976 [Digikey: 475-1278-6-ND] Red LED (12mcd, 20mA, 2.0Vf, Clear) - APT2012EC [Digikey: 754-1128-1-ND] Green LED (15mcd, 20mA, 2.2Vf, Clear) - APT2012GC [Digikey: 754-1131-1-ND] Orange LED (160mcd, 20mA, 2.1Vf, Clear) - APT2012SECK [Digikey: 754-1130-1-ND] 1206 - 1206 Surface Mount Package Green LED (26mcd, 20mA, Diffused) - LG N971 [Digikey: 475-1407-6-ND] Red LED (15mcd, 20mA, Diffused) - LH N974 [Digikey: 475-1416-6-ND] Cree - Cree High-Power Surface Mount LEDs XPEBWT-L1-0000-00D50 - White 111lm 350mA 2.9Vf 6200K 110° XTEAWT-00-0000-00000LEE3 - White 114lm 350mA 2.85Vf 5000K 115° Everlight - Everlight 45-21 Series Surface Mount LEDs 45-21/QK2C-B2832AC2CB2/2T - Warm White 2000mcd 20mA 3.25Vf 3050K 120° 45-21/LK2C-B38452C4CB2/2T - Nuetral White 2000mcd 20mA 3.25Vf 4150K 120° 45-21/LK2C-B50634C6CB2/2T - Cold White 2200mcd 20mA 3.25Vf 5650K 120° PLCC2 Reverse Mount LS T77K-J1L2-1-0-2-R18-Z - Red 11.25mcd 2mA 1.8Vf 630nm 120° LO T77K-L1M2-24-Z - Orange 19.6mcd 2mA 1.8Vf 606nm 120° LY T77K-K2M1-26-Z - Yellow 15.7mcd 2mA 1.8Vf 587nm 120°
D302 = Semiconductors > Discrete Semiconductors > Thyristors > Triacs:BTA16
D401 = Semiconductors > Discrete Semiconductors > Diodes & Rectifiers > Schottky Diodes & Rectifiers:SK54L
F401 = Circuit Protection > Resettable Fuses - PPTC:PTC
J101 = Connectors > card socket:MICROSD
J102 = Connectors > JST > SH:SH-6
J201 = Connectors > USB:USB-SHIELD
J301 J304 = Connectors > Other:PCC-SMP
J302 J303 = Connectors > Header:3X1_2.54
J305 J401 = Connectors > Other:2EDG-2P
J306 J308 = Thermal Management > Fans & Blowers:4P-PC-FAN
J307 = Connectors > Header:2X1_2.54
JP201 JP202 = Utility > Board:JUMPER-SMT_3_1-NC_PASTE: Normally closed solder jumper (1 of 2 connections) This jumper has an aperture in the stencil to allow solder paste to bridge one of the two connections. One connection is normally closed (NC), while the other is normally open (NO). Wick off the solder to open the connection. Reapply solder to reclose the connection. Apply solder to the other side instead to change the current path.
KK301 = Thermal Management > Heatsinks:SK104: HEATSINK manufacturer Fischer/distributor Buerklin
L101 L401 = Passive Components > Inductors, Chokes & Coils:INDUCTOR
LOGO101 = Utility > Silkscreen:DESIGNEDINPT
LOGO102 = Utility > Silkscreen:RAFAEL_SILVA
LOGO103 = Utility > Silkscreen:OSHW-LOGO: Open-Source Hardware (OSHW) Logo This logo indicates the piece of hardware it is found on incorporates a OSHW license and/or adheres to the definition of open source hardware found here: http://freedomdefined.org/OSHW
M201 = Embedded > BLE Module:HM-11
Q201 Q202 Q301-Q303 Q305-Q308 = Semiconductors > Discrete Semiconductors > Transistors > Bipolar Transistors - BJT:BC817-40
Q304 = Opto-electronics > Optocouplers\Photocouplers:MOC3051: The MOC3051-M and MOC3052-M consist of a AlGaAs infrared emitting diode optically coupled to a non-zero-crossing silicon bilateral AC switch (triac). These devices isolate low voltage logic from 115 and 240 Vac lines to provide random phase control of high current triacs or thyristors. These devices feature greatly enhanced static dv/dt capability to ensure stable switching performance of inductive loads.
R101-R106 R201-R214 R301-R328 R401-R406 = Passive Components > Resistors > Chip Resistors:RESISTOR: Resistors For new designs, use the packages preceded by an '_' character since they are more reliable: The following footprints should be used on most boards: _0402 - Standard footprint for regular board layouts _0603 - Standard footprint for regular board layouts _0805 - Standard footprint for regular board layouts _1206 - Standard footprint for regular board layouts For extremely tight-pitch boards where space is at a premium, the following 'micro-pitch' footprints can be used (smaller pads, no silkscreen outline, etc.): _0402MP - Micro-pitch footprint for very dense/compact boards _0603MP - Micro-pitch footprint for very dense/compact boards _0805MP - Micro-pitch footprint for very dense/compact boards _1206MP - Micro-pitch footprint for very dense/compact boards
SW101 = Eletromechanical > Switches > Tactile Switches:PUSH_BUTTON
TP1-TP22 TP26 TP201 TP202 TP301 TP302 = Utility > Board:TEST_POINT
U101 = Semiconductors > Embedded Processors & Controllers > Microcontrollers - MCU:EFM32GG11B8XX_Q100
U102 = Semiconductors > Integrated Circuits - ICs > Memory ICs > Flash:SST26VF064B
U201 = Semiconductors > Integrated Circuits - ICs > Logic ICs > Logic Gates:74LVC1G08
U202 = Semiconductors > Integrated Circuits - ICs > Logic ICs > Logic Gates:74HC123
U203 = Semiconductors > Integrated Circuits - ICs > Logic ICs > Logic Gates:74LVC1G32
U204 = Opto-electronics > Displays:ER-TFT035-6
U205 = Semiconductors > Integrated Circuits - ICs > Interface ICs > USB Interface IC:CP2102N
U301 U302 = Sensors > Temperature Sensors:MCP9600
U303 = Opto-electronics > Optocouplers\Photocouplers:H11AA1
U401 = Power > Switching Controllers:MIC4682
Y101 Y102 = Passive Components > Frequency Control & Timing Devices > Crystals:CRYSTAL: Citizen CM200S & CM250S Series